# Altium project PCB_Project.PrjPcb
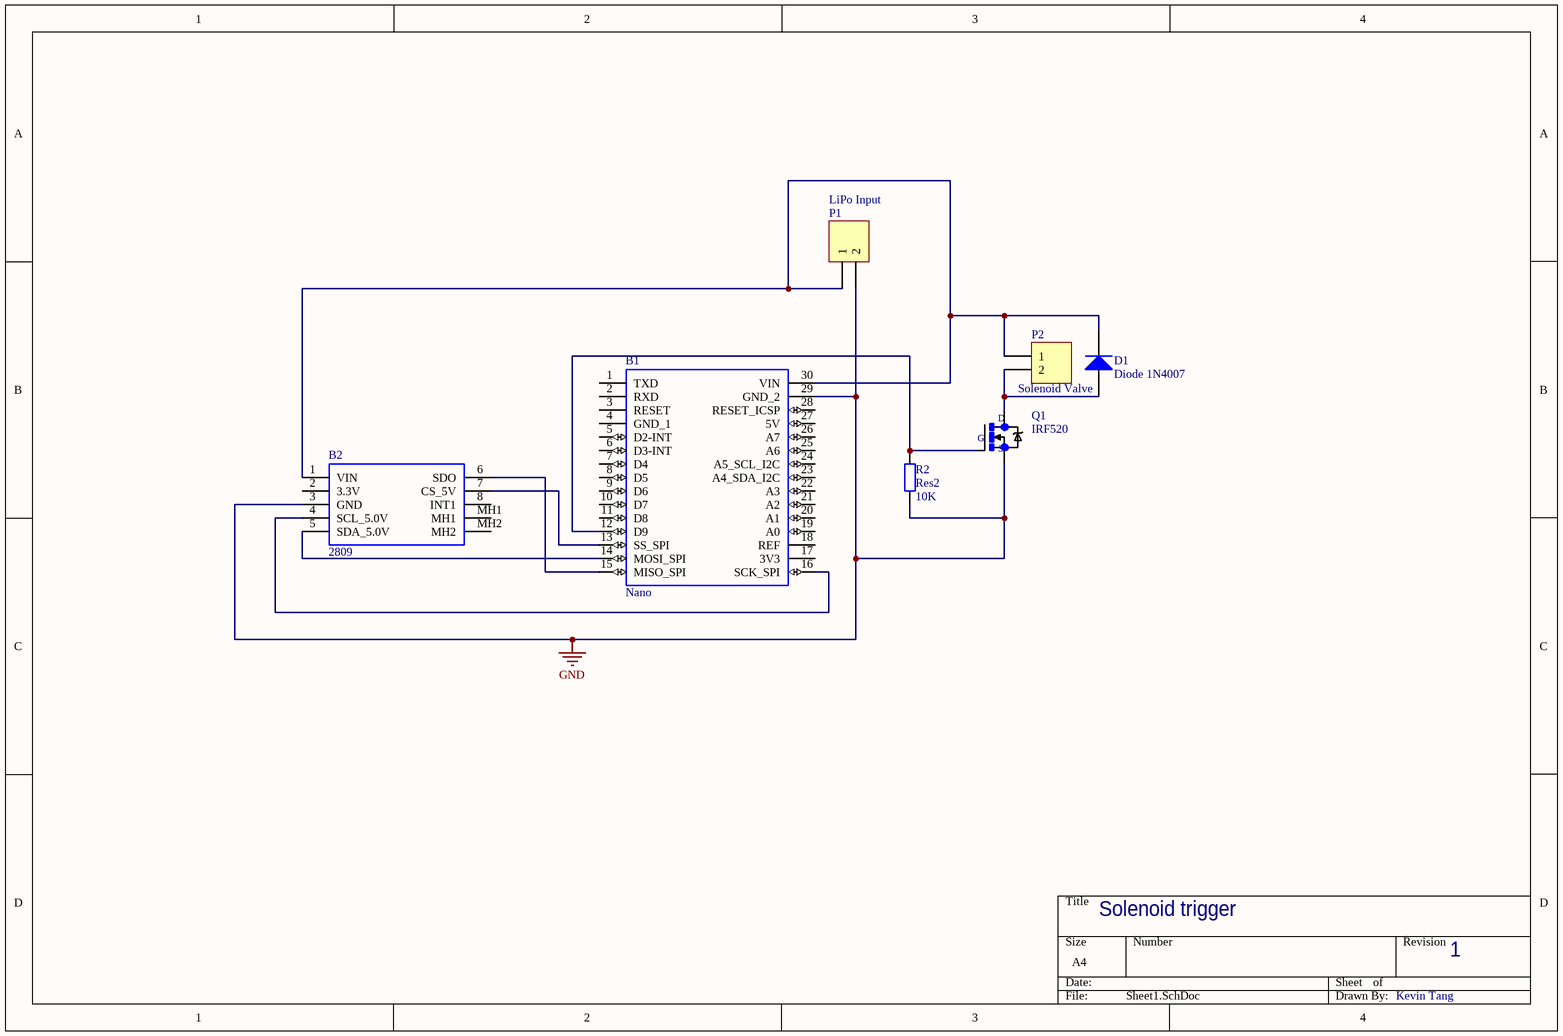
[diagram p0: Sheet1.SchDoc]
1 sheet, 7 parts. Net scope: global (net labels, ports and power ports of the same name join across sheets).
Board file: PCB1.PcbDoc

## Sheet Sheet1.SchDoc
size A4

### Parts
B1  Nano  [DIP1524W102P254L4318H762Q30N]
B2  2809  [2809]
D1  Diode 1N4007  [DO-41]
P1  LiPo Input  [HDR1X2]
P2  Solenoid Valve  [HDR1X2]
Q1  IRF520  [TO220BV_IRF520(Primary)]
R2  Res2  value 10K  [AXIAL-0.4]

### Nets
GND: B1.29(GND_2) B2.3(GND) P1.2 Q1.S R2.1
NetB1_12: B1.12(D9) Q1.G R2.2
NetB1_13: B1.13(SS_SPI) B2.7(CS_5V)
NetB1_14: B1.14(MOSI_SPI) B2.5(SDA_5.0V)
NetB1_15: B1.15(MISO_SPI) B2.6(SDO)
NetB1_16: B1.16(SCK_SPI) B2.4(SCL_5.0V)
NetB1_30: B1.30(VIN) B2.1(VIN) D1.2(K) P1.1 P2.1
NetD1_1: D1.1(A) P2.2 Q1.D

Not connected (* = marked no-connect by the designer): B1 1(TXD) 2(RXD) 3(RESET) 4(GND_1) 5(D2-INT) 6(D3-INT) 7(D4) 8(D5) 9(D6) 10(D7) 11(D8) 17(3V3) 18(REF) 19(A0) 20(A1) 21(A2) 22(A3) 23(A4_SDA_I2C) 24(A5_SCL_I2C) 25(A6) 26(A7) 27(5V) 28(RESET_ICSP); B2 2(3.3V) 8(INT1) MH1 MH2

### Notes on the sheet
- Solenoid trigger
- 1
- Kevin Tang

### Library data of the parts
B1 = Nano: Development Boards & Kits - AVR ARDUINO NANO V3 A000005; Allied_Number: 70518857; Geometry.Height: 7.62mm; Manufacturer_Name: Arduino; Manufacturer_Part_Number: Nano; RS Part Number: 6961667; RS Price/Stock: http://uk.rs-online.com/web/p/products/6961667; Allied Price/Stock: http://www.alliedelec.com/arduino-a000005/70518857/; Mouser Part Number: 992-ARD-NANO30; Mouser Price/Stock: http://www.mouser.com/Search/ProductDetail.aspx?qs=Vxac6xGyzPmCaTfvE003gg%3d%3d; Datasheet Link: http://docs-emea.rs-online.com/webdocs/0db9/0900766b80db99cb.pdf
B2 = 2809: Acceleration Sensor Development Tools Adafruit LIS3DH Triple-Axis Accelerometer (+-2g/4g/8g/16g); Geometry.Height: 5mm; Manufacturer_Name: Adafruit; Manufacturer_Part_Number: 2809; RS Part Number: *; RS Price/Stock: *; Mouser Part Number: 485-2809; Mouser Price/Stock: https://www.mouser.com/Search/Refine.aspx?Keyword=485-2809; Datasheet Link: http://www.mouser.com/datasheet/2/737/adafruit-lis3dh-triple-axis-accelerometer-breakout-780345.pdf
D1 = Diode 1N4007: 1 Amp General Purpose Rectifier; Published: 8-Jun-2000; LatestRevisionDate: 17-Jul-2002; LatestRevisionNote: Re-released for DXP Platform.; DatasheetVersion: 1998; PackageVersion: Aug-1999; PackageReference: DO-41; Publisher: Altium Limited; PackageDescription: Diode, Axial; Body 5.2 x 2.7 mm (LxDia. max), Lead Dia. 0.86 mm (max); Code_JEDEC: DO-204-AL; ComponentLink1Description: Manufacturer Link; ComponentLink1URL: http://www.fairchildsemi.com/; ComponentLink2Description: Datasheet; ComponentLink2URL: http://www.fairchildsemi.com/ds/1N%2F1N4001.pdf
P1 P2 = Header 2: Header, 2-Pin; LatestRevisionDate: 17-Jul-2002; LatestRevisionNote: Re-released for DXP Platform.; Publisher: Altium Limited
R2 = Res2: Resistor; Published: 8-Jun-2000; LatestRevisionDate: 17-Jul-2002; LatestRevisionNote: Re-released for DXP Platform.; PackageReference: AXIAL-0.4; Publisher: Altium Limited; PackageDescription: Axial Device, Thru-Hole; 2 Leads; 0.4 in Pin Spacing
Q1 = IRF520: Value: *